# EAGLE design Xonik Waveshaper v2.1 (EAGLE 9.6.2)
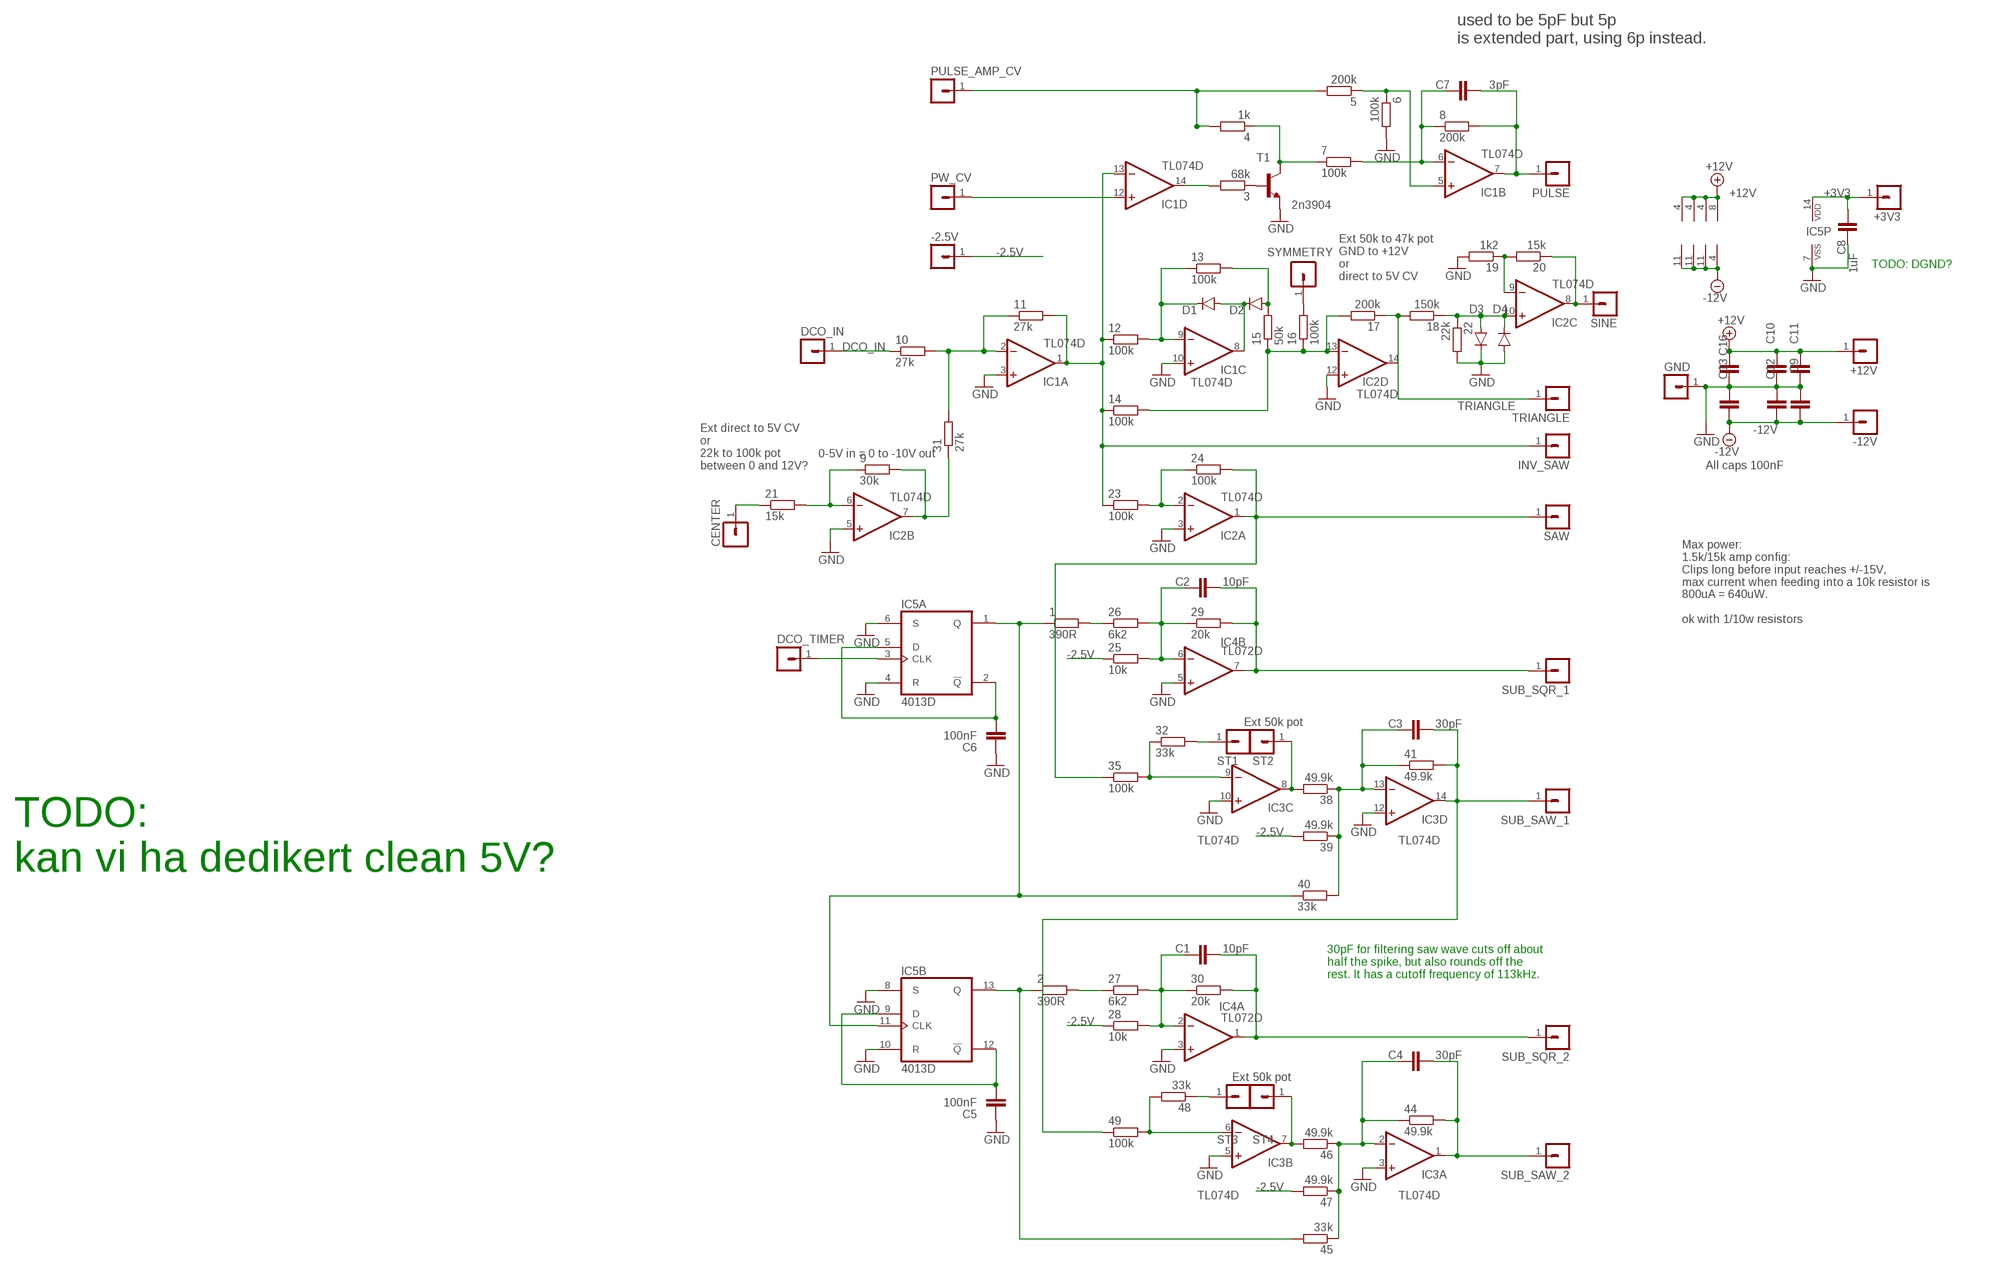
[diagram p0: schematic, sheet 1]

## Parts
1  390R  R-EU_R0603  [R0603]
2  390R  R-EU_R0603  [R0603]
3  68k  R-EU_R0603  [R0603]
4  1k  R-EU_R0603  [R0603]
5  200k  R-EU_R0603  [R0603]
6  100k  R-EU_R0603  [R0603]
7  100k  R-EU_R0603  [R0603]
8  200k  R-EU_R0603  [R0603]
9  30k  R-EU_R0603  [R0603]
10  27k  R-EU_R0603  [R0603]
11  27k  R-EU_R0603  [R0603]
12  100k  R-EU_R0603  [R0603]
13  100k  R-EU_R0603  [R0603]
14  100k  R-EU_R0603  [R0603]
15  50k  R-EU_R0603  [R0603]
16  100k  R-EU_R0603  [R0603]
17  200k  R-EU_R0603  [R0603]
18  150k  R-EU_R0603  [R0603]
19  1k2  R-EU_R0603  [R0603]
20  15k  R-EU_R0603  [R0603]
21  15k  R-EU_R0603  [R0603]
22  22k  R-EU_R0805  [R0805]
23  100k  R-EU_R0603  [R0603]
24  100k  R-EU_R0603  [R0603]
25  10k  R-EU_R0603  [R0603]
26  6k2  R-EU_R0603  [R0603]
27  6k2  R-EU_R0603  [R0603]
28  10k  R-EU_R0603  [R0603]
29  20k  R-EU_R0603  [R0603]
30  20k  R-EU_R0603  [R0603]
31  27k  R-EU_R0603  [R0603]
32  33k  R-EU_R0603  [R0603]
35  100k  R-EU_R0603  [R0603]
38  49.9k  R-EU_R0603  [R0603]
39  49.9k  R-EU_R0603  [R0603]
40  33k  R-EU_R0603  [R0603]
41  49.9k  R-EU_R0603  [R0603]
44  49.9k  R-EU_R0603  [R0603]
45  33k  R-EU_R0603  [R0603]
46  49.9k  R-EU_R0603  [R0603]
47  49.9k  R-EU_R0603  [R0603]
48  33k  R-EU_R0603  [R0603]
49  100k  R-EU_R0603  [R0603]
+3V3  MA01-1JP  [SIP-PIN01-1J]
+12V  MA01-1JP  [SIP-PIN01-1J]
-2.5V  MA01-1JP  [SIP-PIN01-1J]
-12V  MA01-1JP  [SIP-PIN01-1J]
C1  10pF  C-EUC0603  [C0603]
C2  10pF  C-EUC0603  [C0603]
C3  30pF  C-EUC0603  [C0603]
C4  30pF  C-EUC0603  [C0603]
C5  100nF  C-EUC0603  [C0603]
C6  100nF  C-EUC0603  [C0603]
C7  3pF  C-EUC0603  [C0603]
C8  1uF  C-EUC0402  [C0402]
C9  1uF  C-EUC0402  [C0402]
C10  1uF  C-EUC0402  [C0402]
C11  1uF  C-EUC0402  [C0402]
C12  1uF  C-EUC0402  [C0402]
C13  1uF  C-EUC0402  [C0402]
C16  1uF  C-EUC0402  [C0402]
CENTER  MA01-1JP  [SIP-PIN01-1J]
D1  1N41480805  [D0805-J]
D2  1N41480805  [D0805-J]
D3  1N41480805  [D0805-J]
D4  1N41480805  [D0805-J]
DCO_IN  MA01-1JP  [SIP-PIN01-1J]
DCO_TIMER  MA01-1JP  [SIP-PIN01-1J]
GND  MA01-1JP  [SIP-PIN01-1J]
IC1  TL074D  [SO14]
IC2  TL074D  [SO14]
IC3  TL074D  [SO14]
IC4  TL072D  [SO08J]
IC5  4013D  [SO14J]
INV_SAW  MA01-1JP  [SIP-PIN01-1J]
PULSE  MA01-1JP  [SIP-PIN01-1J]
PULSE_AMP_CV  MA01-1JP  [SIP-PIN01-1J]
PW_CV  MA01-1JP  [SIP-PIN01-1J]
SAW  MA01-1JP  [SIP-PIN01-1J]
SINE  MA01-1JP  [SIP-PIN01-1J]
ST1  MA01-1JP  [SIP-PIN01-1J]
ST2  MA01-1JP  [SIP-PIN01-1J]
ST3  MA01-1JP  [SIP-PIN01-1J]
ST4  MA01-1JP  [SIP-PIN01-1J]
SUB_SAW_1  MA01-1JP  [SIP-PIN01-1J]
SUB_SAW_2  MA01-1JP  [SIP-PIN01-1J]
SUB_SQR_1  MA01-1JP  [SIP-PIN01-1J]
SUB_SQR_2  MA01-1JP  [SIP-PIN01-1J]
SYMMETRY  MA01-1JP  [SIP-PIN01-1J]
T1  2n3904  MMBT3904LT1-NPN-SOT23-BEC  [SOT23-BEC]
TRIANGLE  MA01-1JP  [SIP-PIN01-1J]

## Nets
+3V3: +3V3.1 C8.2 IC5.14(P:VDD)
+12V: +12V.1 C10.2 C11.2 C16.2 IC1.4(P:V+) IC2.4(P:V+) IC3.4(P:V+) IC4.8(P:V+)
-2.5V: 25.1 28.1 39.2 47.2 -2.5V.1
-12V: -12V.1 C9.1 C12.1 C13.1 IC1.11(P:V-) IC2.11(P:V-) IC3.11(P:V-) IC4.4(P:V-)
AMP_CV: 4.2 5.2 PULSE_AMP_CV.1
DCO_IN: 10.1 DCO_IN.1
GND: 6.2 19.2 22.2 C5.1 C6.1 C8.1 C9.2 C10.1 C11.1 C12.2 C13.2 C16.1 D3.C D4.A GND.1 IC1.3(A:+IN) IC1.10(C:+IN) IC2.3(A:+IN) IC2.5(B:+IN) IC2.12(D:+IN) IC3.3(A:+IN) IC3.5(B:+IN) IC3.10(C:+IN) IC3.12(D:+IN) IC4.3(A:+IN) IC4.5(B:+IN) IC5.4(A:R) IC5.6(A:S) IC5.7(P:VSS) IC5.8(B:S) IC5.10(B:R) T1.E
N$1: 9.1 21.2 IC2.6(B:-IN)
N$2: 3.2 IC1.14(D:OUT)
N$3: 3.1 T1.B
N$4: 4.1 7.1 T1.C
N$5: 5.1 6.1 IC1.5(B:+IN)
N$6: 7.2 8.1 C7.1 IC1.6(B:-IN)
N$7: 8.2 C7.2 IC1.7(B:OUT) PULSE.1
N$8: 1.2 26.1
N$9: 11.2 12.1 14.1 23.1 IC1.1(A:OUT) IC1.13(D:-IN) INV_SAW.1
N$10: 10.2 11.1 31.2 IC1.2(A:-IN)
N$11: 12.2 13.1 D1.C IC1.9(C:-IN)
N$12: D1.A D2.C IC1.8(C:OUT)
N$13: 13.2 15.2 D2.A
N$14: 14.2 15.1 16.1 17.2 IC2.13(D:-IN)
N$15: 23.2 24.1 IC2.2(A:-IN)
N$16: 24.2 35.1 IC2.1(A:OUT) SAW.1
N$17: 29.2 C2.2 IC4.7(B:OUT) SUB_SQR_1.1
N$18: 30.2 C1.2 IC4.1(A:OUT) SUB_SQR_2.1
N$19: 25.2 26.2 29.1 C2.1 IC4.6(B:-IN)
N$20: 46.2 IC3.7(B:OUT) ST4.1
N$21: 48.2 49.2 IC3.6(B:-IN)
N$22: 27.2 28.2 30.1 C1.1 IC4.2(A:-IN)
N$23: 32.2 ST1.1
N$24: 32.1 35.2 IC3.9(C:-IN)
N$25: 2.2 27.1
N$26: 38.1 39.1 40.2 41.1 C3.1 IC3.13(D:-IN)
N$27: 41.2 49.1 C3.2 IC3.14(D:OUT) SUB_SAW_1.1
N$28: 48.1 ST3.1
N$29: 44.1 45.1 46.1 47.1 C4.1 IC3.2(A:-IN)
N$30: 44.2 C4.2 IC3.1(A:OUT) SUB_SAW_2.1
N$31: C6.2 IC5.2(A:!Q) IC5.5(A:D)
N$32: 1.1 40.1 IC5.1(A:Q) IC5.11(B:CLK)
N$33: IC1.12(D:+IN) PW_CV.1
N$34: C5.2 IC5.9(B:D) IC5.12(B:!Q)
N$35: 2.1 45.2 IC5.13(B:Q)
N$36: 19.1 20.2 IC2.9(C:-IN)
N$37: 16.2 SYMMETRY.1
N$38: 21.1 CENTER.1
N$39: 18.1 22.1 D3.A D4.C IC2.10(C:+IN)
N$40: 20.1 IC2.8(C:OUT) SINE.1
N$41: 38.2 IC3.8(C:OUT) ST2.1
N$42: 9.2 31.1 IC2.7(B:OUT)
SQR: DCO_TIMER.1 IC5.3(A:CLK)
TRIANGLE: 17.1 18.2 IC2.14(D:OUT) TRIANGLE.1

## Notes on the sheet
- used to be 5pF but 5p
  is extended part, using 6p instead.
- TODO: DGND?
- Ext 50k to 47k pot 
  GND to +12V
  or
  direct to 5V CV
- 0-5V in = 0 to -10V out
- Ext direct to 5V CV
  or 
  22k to 100k pot
  between 0 and 12V?
- All caps 100nF
- Max power:
  1.5k/15k amp config:
  Clips long before input reaches +/-15V,
  max current when feeding into a 10k resistor is
  800uA = 640uW. 
  
  ok with 1/10w resistors
- Ext 50k pot
- TODO: 
  kan vi ha dedikert clean 5V?
- 30pF for filtering saw wave cuts off about
  half the spike, but also rounds off the
  rest. It has a cutoff frequency of 113kHz.
- Ext 50k pot

## Library data of the parts
1-21 23-32 35 38-41 44-49 = rcl:R-EU_: RESISTOR, European symbol; SPICEPREFIX: R
22 = resistor:R-EU_: RESISTOR, European symbol
+3V3 +12V -2.5V -12V CENTER DCO_IN DCO_TIMER GND INV_SAW PULSE PULSE_AMP_CV PW_CV SAW SINE ST1-ST4 SUB_SAW_1 SUB_SAW_2 SUB_SQR_1 SUB_SQR_2 SYMMETRY TRIANGLE = joakim:MA01-1J: PIN HEADER
C1-C13 C16 = rcl:C-EU: CAPACITOR, European symbol; SPICEPREFIX: C
D1-D4 = joakim:1N4148: DIODE high speed (Philips)
IC1-IC3 = linear:TL074: OP AMP
IC4 = joakim:TL072: OP AMP
IC5 = joakim:4013: Dual D FLIP FLOP, set/reset
T1 = transistor-neu-to92:*-NPN-: NPN Transistror

## Board
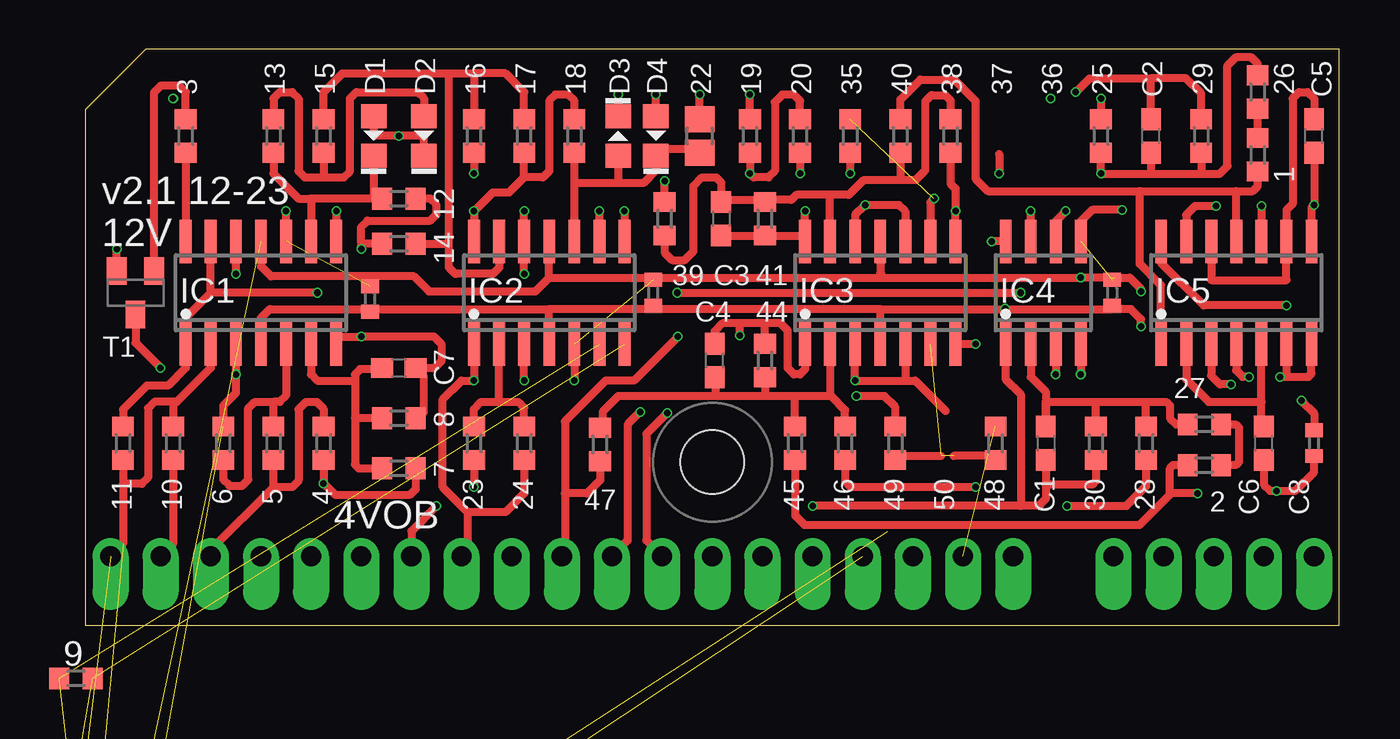
[diagram p1: board, top side]
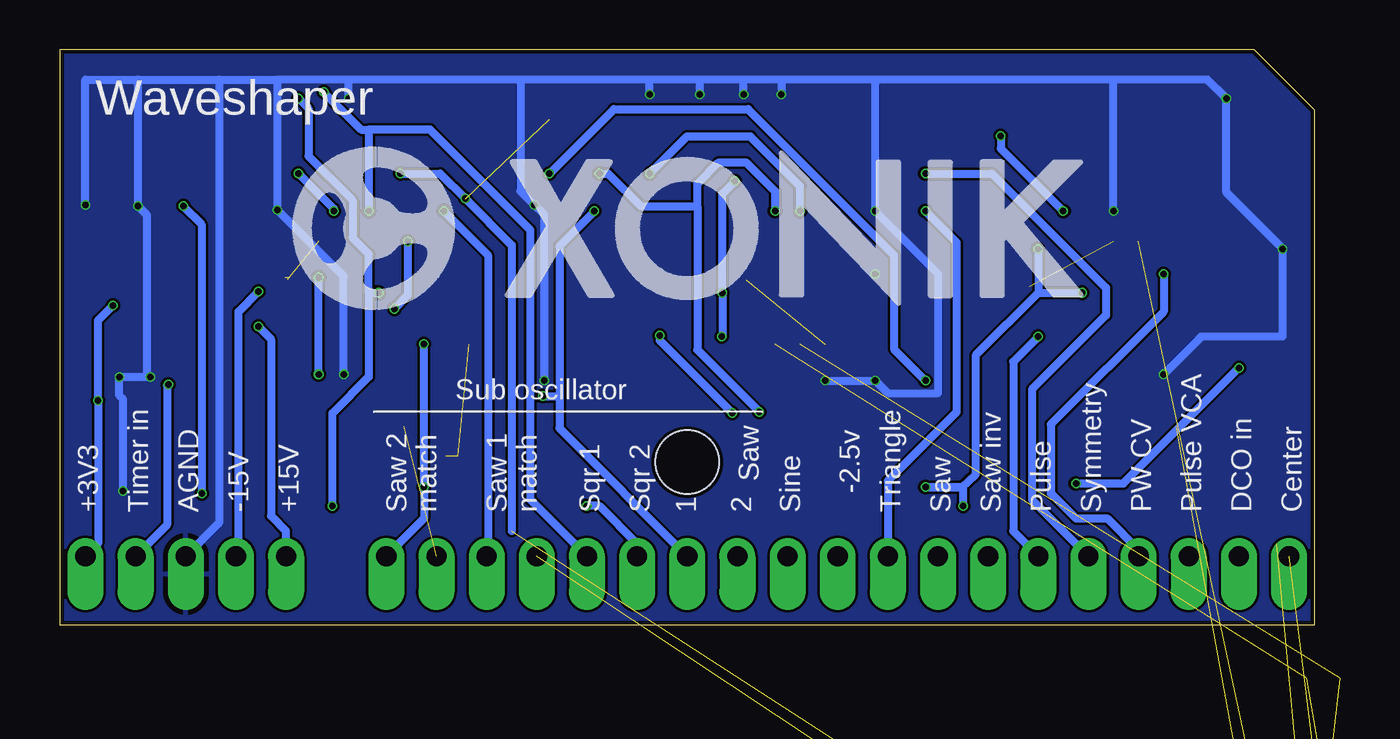
[diagram p2: board, bottom side, seen from below]

Size 63.5 x 29.15 mm. Coordinates in mm from the lower left corner, seen from the top.
Outline: 0,0 63.5,0 63.5,29.15 3.05,29.15 0,26.1 0,0
Copper layers (1*16): Top 0.035mm / dielectric 1.6mm / Bottom 0.035mm
Design rules "jlcpcb-2layers": minimum track width 5mil, minimum drill 0.3mm, track to track 5mil, track to pad 5mil, pad to pad 5mil, via to via 5mil, smd to smd 5mil, copper to edge 0.2mm, drill to drill 6mil, minimum pad ring 10mil, minimum via ring 3mil, stop-mask expansion 4mil, vias tented up to drill 0mil, thermal gap 10mil
Holes 3.2 mm at 31.75,8.26

### Footprints (pad centres in the part's own frame; a part is rotated, then mirrored left to right if it is on the bottom)
R0603 = smd 1 x 1.1: 1 -0.85,0; 2 0.85,0
R0805 = smd 1.3 x 1.5: 1 -0.85,0; 2 0.85,0
SIP-PIN01-1J = drill 1.016 offset: 1 0,0
C0603 = smd 1.1 x 1: 1 -0.85,0; 2 0.85,0
C0402 = smd 0.7 x 0.9: 1 -0.65,0; 2 0.65,0
D0805-J = smd 1.2 x 1.3: A -1,0; C 1,0
SO14 = smd 0.6 x 2.2: 1 -3.81,-2.6; 2 -2.54,-2.6; 3 -1.27,-2.6; 4 0,-2.6; 5 1.27,-2.6; 6 2.54,-2.6; 7 3.81,-2.6; 8 3.81,2.6; 9 2.54,2.6; 10 1.27,2.6; 11 0,2.6; 12 -1.27,2.6; 13 -2.54,2.6; 14 -3.81,2.6
SO08J = smd 0.6 x 2.2: 1 -1.905,-2.6; 2 -0.635,-2.6; 3 0.635,-2.6; 4 1.905,-2.6; 5 1.905,2.6; 6 0.635,2.6; 7 -0.635,2.6; 8 -1.905,2.6
SO14J = smd 0.6 x 2.2: 1 -3.81,-2.6; 2 -2.54,-2.6; 3 -1.27,-2.6; 4 0,-2.6; 5 1.27,-2.6; 6 2.54,-2.6; 7 3.81,-2.6; 8 3.81,2.6; 9 2.54,2.6; 10 1.27,2.6; 11 0,2.6; 12 -1.27,2.6; 13 -2.54,2.6; 14 -3.81,2.6
SOT23-BEC = smd 1 x 1.4: B -0.95,-1.1; C 0,1.1; E 0.95,-1.1

### Placement (x,y rotation side)
1  59.37,23.81 90 top
2  56.67,8.1 0 top
3  5.08,24.77 270 top
4  12.06,9.21 90 top
5  9.53,9.21 270 top
6  6.99,9.21 90 top
7  15.88,7.94 180 top
8  15.88,10.48 0 top
9  -0.48,-2.7 0 top
10  4.45,9.21 90 top
11  1.91,9.21 90 top
12  15.88,21.59 180 top
13  9.53,24.77 90 top
14  15.88,19.3 0 top
15  12.06,24.77 270 top
16  19.68,24.77 270 top
17  22.23,24.77 90 top
18  24.77,24.77 90 top
19  33.66,24.77 90 top
20  36.2,24.77 90 top
21  -0.48,-17.46 0 top  (outside the outline)
22  31.11,24.77 90 top
23  19.68,9.21 90 top
24  22.23,9.21 270 top
25  51.44,24.77 270 top
26  59.37,26.99 90 top
27  56.67,10.16 180 top
28  53.72,9.21 90 top
29  56.52,24.77 90 top
30  51.18,9.21 270 top
31  -0.48,-12.54 0 top  (outside the outline)
32  -0.48,-22.38 0 top  (outside the outline)
35  38.73,24.77 90 top
38  43.81,24.77 270 top
39  29.34,20.57 90 top
40  41.27,24.77 270 top
41  34.42,20.57 270 top
44  34.42,13.4 90 top
45  35.94,9.21 270 top
46  38.48,9.21 270 top
47  26.07,9.14 270 top
48  46.1,9.21 270 top
49  41.02,9.21 270 top
+3V3  62.23,3.49 0 top
+12V  52.07,3.49 0 top
-2.5V  24.13,3.49 0 top
-12V  54.61,3.49 0 top
C1  48.64,9.21 270 top
C2  53.98,24.77 90 top
C3  32.19,20.57 270 top
C4  31.88,13.4 90 top
C5  62.23,24.77 90 top
C6  59.69,9.21 90 top
C7  15.88,13.02 0 top
C8  62.23,9.21 90 top
C9  -0.48,-27.3 0 top  (outside the outline)
C10  28.77,16.83 270 top
C11  14.41,16.51 270 top
C12  -0.48,-32.23 0 top  (outside the outline)
C13  -0.48,-37.15 0 top  (outside the outline)
C16  52.01,16.83 270 top
CENTER  1.27,3.49 0 top
D1  14.61,24.77 270 top
D2  17.14,24.77 270 top
D3  26.99,24.77 90 top
D4  28.89,24.77 270 top
DCO_IN  3.81,3.49 0 top
DCO_TIMER  59.69,3.49 0 top
GND  57.15,3.49 0 top
IC1  8.89,16.83 0 top
IC2  23.5,16.83 0 top
IC3  40.26,16.83 0 top
IC4  48.51,16.83 0 top
IC5  58.29,16.83 0 top
INV_SAW  16.51,3.49 0 top
PULSE  13.97,3.49 0 top
PULSE_AMP_CV  6.35,3.49 0 top
PW_CV  8.89,3.49 0 top
SAW  19.05,3.49 0 top
SINE  26.67,3.49 0 top
ST1  39.37,3.49 0 top
ST2  41.91,3.49 0 top
ST3  44.45,3.49 0 top
ST4  46.99,3.49 0 top
SUB_SAW_1  31.75,3.49 0 top
SUB_SAW_2  29.21,3.49 0 top
SUB_SQR_1  36.83,3.49 0 top
SUB_SQR_2  34.29,3.49 0 top
SYMMETRY  11.43,3.49 0 top
T1  2.54,16.83 180 top
TRIANGLE  21.59,3.49 0 top
U$1  [XONIK_LOGO_40]  51.72,16.02 0 bottom

### Tracks (layer width: path | path; a pad name or v marks a point on that pad's centre or on a via)
+3V3  (via drill 0.33)
  Top 0.406: v60.83,16.19 56.64,16.19 54.48,18.35 IC5.14 | v61.59,11.37 62.23,10.73 C8.2
  Bottom 0.406: +3V3.1 61.59,4.13 v61.59,11.37 61.59,15.43 v60.83,16.19
+12V  (via drill 0.33, 0.35)
  Top 0.152: IC1.4 8.89,14.35
  Top 0.406: 8.89,14.35 8.89,15.56 9.34,16 14.29,16 | 14.29,16 23.5,16 | 23.5,16 28.72,16 C10.2 28.82,16 40.26,16 | IC2.4 23.5,16 | IC3.4 40.26,16 | IC4.8 v45.91,19.43 | C11.2 14.41,15.88 14.29,16 | 51.96,16 C16.2 | 40.26,16 46.57,16 | 46.57,16 51.96,16 | v46.58,16.02 46.57,16 | v53.47,15.11 53.47,15.49 52.96,16 51.96,16
  Bottom 0.406: +12V.1 52.07,4.76 52.83,5.52 52.83,14.48 v53.47,15.11 | v46.58,16.02 45.91,16.69 v45.91,19.43
-2.5V  (via drill 0.33)
  Top 0.406: v29.97,16.83 v47.37,16.83 | 28.1 53.72,7.02 52.73,6.03 v49.72,6.03 | v51.44,26.67 25.1 | 39.2 v29.34,22.48 | v30,14.61 27.78,12.38 26.35,12.38 24.29,10.32 24.29,6.67 | 47.2 26.07,7.33 25.4,6.67 24.29,6.67 | 24.29,6.67 24.29,3.65 -2.5V.1
  Bottom 0.406: v29.34,22.48 29.97,21.84 v29.97,16.83 29.97,14.64 v30,14.61 | v49.72,6.03 49.72,10.73 47.88,12.57 47.88,16.83 | v51.44,26.67 50.93,26.16 50.93,23.75 48.7,21.53 48.7,19.62 47.88,18.8 47.88,16.83 | 47.88,16.83 v47.37,16.83
-12V  (via drill 0.33)  (4 unrouted)
  Top 0.406: IC1.11 8.89,18.16 9.4,17.65 14.41,17.65 16.64,17.65 17.4,16.89 22.73,16.89 22.8,16.89 23.5,17.59 | 23.5,17.59 28.65,17.59 40.45,17.59 | 40.45,17.59 40.26,17.78 IC3.11 | 40.45,17.59 v50.42,17.59 51.89,17.59 | IC4.4 v50.42,12.7 | 23.5,17.59 IC2.11 | 52.12,17.59 52.9,17.59 53.47,17.02 v53.47,16.89
  Bottom 0.406: -12V.1 54.48,3.62 54.48,15.88 v53.47,16.89 | v50.42,12.7 v50.42,17.59
AMP_CV
  Top 0.406: 4.2 12.06,10.95 11.72,11.3 11.18,11.3 10.79,10.92 10.79,7.3 10.48,6.99 9.53,6.99 | PULSE_AMP_CV.1 6.35,3.81 9.53,6.99 | 9.53,6.99 5.2
DCO_IN
  Top 0.406: 10.1 4.45,4.13 DCO_IN.1
GND  (via drill 0.33)  (6 unrouted)
  Top 0.406: IC3.12 38.99,20.77 v39.5,21.27 41.21,21.27 41.53,20.95 IC3.10 | IC3.5 41.53,12.38 | IC3.3 v38.99,12.38 41.53,12.38 | C5.1 v62.23,21.27 62.1,21.14 IC5.8 | v52.51,21.02 50.99,21.02 50.42,20.45 IC4.5 | 43.56,10.85 42.03,12.38 41.53,12.38 | v22.23,20.95 IC2.12 v22.23,17.78 | v22.23,12.38 IC2.3 | v59.56,21.21 IC5.10 | IC4.3 v49.15,12.7 | IC5.4 58.29,12.89 58.61,12.57 v58.93,12.57 | 6.2 6.99,11.11 7.62,11.75 IC1.3 v7.62,12.7 | IC1.10 v10.16,20.95 | v26.99,26.86 D3.C | T1.E v1.59,19.05 | C6.1 59.69,7.11 60.01,6.79 v60.33,6.79 61.28,6.79 62.23,7.75 C8.1 | D4.A v28.89,26.86 | 22.2 v31.11,26.86 | 19.2 v33.66,26.86 | IC2.5 v24.77,12.38 | v60.52,12.57 60.8,12.57 | 60.8,12.57 61.94,12.57 62.1,12.73 IC5.7 | IC5.6 60.83,12.61 60.8,12.57
  Bottom 0.406: v62.23,21.27 62.23,27.62 59.56,27.62 | 59.56,27.62 55.47,27.62 | 55.47,27.62 52.51,27.62 | 52.51,27.62 v52.51,21.02 49.15,17.65 v49.15,12.7 | 40.2,27.62 40.2,21.97 v39.5,21.27 38.99,20.77 v38.99,12.38 | 40.2,27.62 48.9,27.62 | 48.9,27.62 52.51,27.62 | 26.99,27.62 28.89,27.62 | 28.89,27.62 31.11,27.62 | 31.11,27.62 33.66,27.62 | 33.66,27.62 40.2,27.62 | 59.56,27.62 v59.56,21.21 59.12,20.77 59.12,12.76 v58.93,12.57 v60.52,12.57 60.52,11.62 60.33,11.43 v60.33,6.79 | GND.1 55.47,5.17 55.47,27.62 | v10.16,20.95 10.16,27.62 | 10.16,27.62 22.23,27.62 | 22.23,27.62 26.99,27.62 | 26.99,27.62 v26.99,26.86 | 10.16,27.62 5.4,27.62 v4.45,26.67 4.45,21.91 v1.59,19.05 1.59,14.61 5.71,14.61 v7.62,12.7 | 22.23,27.62 v22.23,20.95 19.05,17.78 19.05,11.75 21.59,11.75 v22.23,12.38 v24.77,12.38 | v48.9,26.67 48.9,27.62 | v31.11,26.86 31.11,27.62 | v28.89,26.86 28.89,27.62 | v33.66,26.86 33.66,27.62
  pour Bottom: -0.51,29.34 64.2,29.34 64.52,29.02 64.52,0.32 64.07,-0.13 -0.51,-0.13 -0.83,0.19 -0.83,29.02
N$1  (2 unrouted)
N$2
  Top 0.406: 3.2 IC1.14
N$3
  Top 0.406: T1.B 3.49,17.61 3.49,26.99 3.81,27.3 4.76,27.3 5.08,26.99 3.1
N$4  (via drill 0.33)
  Top 0.406: T1.C 2.54,14.29 v3.81,13.02 | 7.1 16.73,6.88 16.45,6.6 12.64,6.6 v12.06,7.18 4.1
  Bottom 0.406: v12.06,7.18 9.65,7.18 v3.81,13.02
N$5
  Top 0.406: IC1.5 10.16,11.62 9.84,11.3 9.53,11.3 | 6.1 6.99,7.37 7.3,7.05 7.94,7.05 8.26,7.37 8.26,10.99 8.57,11.3 9.53,11.3 | 5.1 9.53,11.3
N$6
  Top 0.406: IC1.6 11.43,12.7 11.75,12.38 13.65,12.38 | C7.1 14.96,12.95 13.91,12.95 13.65,12.7 13.65,12.38 | 13.65,12.38 13.65,10.48 | 13.65,10.48 13.65,8.13 13.84,7.94 7.2 | 8.1 13.65,10.48
N$7  (via drill 0.33)
  Top 0.406: IC1.7 12.7,14.61 v13.97,14.61 17.65,14.61 18.03,14.22 18.03,13.37 17.68,13.02 C7.2 17.14,12.6 17.14,10.79 16.83,10.48 8.2
  Bottom 0.406: PULSE.1 15.24,4.76 15.24,13.34 v13.97,14.61
N$8
  Top 0.406: 1.2 26.1
N$9  (via drill 0.33)
  Top 0.406: 11.2 1.91,10.92 3.11,12.13 4.19,12.13 5.08,13.02 IC1.1 5.08,15.56 6.35,16.83 | 6.35,16.83 IC1.13 | v11.75,16.83 6.35,16.83 | 23.1 v19.68,6.99 | v17.78,6.03 16.51,4.76 INV_SAW.1 | 12.1 17.46,21.59 17.78,21.27 17.78,20.8 17.46,20.48 14.29,20.48 13.97,20.16 13.97,19.37 14.03,19.3 | 14.1 14.03,19.3 | v13.97,19.05 13.97,19.24 14.03,19.3
  Bottom 0.406: v17.78,6.03 17.78,6.99 v19.68,6.99 17.85,6.99 17.14,7.62 17.14,13.65 13.97,16.83 | v13.97,19.05 13.97,16.83 | 13.97,16.83 v11.75,16.83
N$10  (1 unrouted)
  Top 0.406: IC1.2 6.35,13.02 4.64,11.3 4.51,11.3 | 4.51,11.3 4.45,11.24 10.2 | 4.51,11.3 3.49,11.3 3.17,10.99 3.17,7.46 2.86,7.14 1.91,7.14 | 11.1 1.91,7.14 | 1.91,7.14 1.91,4.13
N$11
  Top 0.406: 13.1 9.53,22.86 10.79,21.59 11.43,21.59 | 11.43,21.59 IC1.9 | 14.61,21.91 15.24,21.91 15.03,21.69 12.2 | 11.43,21.59 14.61,21.59 14.61,21.91 | D1.C 14.61,21.91
N$12  (via drill 0.33)
  Top 0.406: v12.7,20.95 IC1.8 | D1.A 14.61,24.77 v15.88,24.77 17.14,24.77 D2.C
  Bottom 0.406: v15.88,24.77 15.88,24.13 v12.7,20.95
N$13
  Top 0.406: D2.A 17.14,26.67 16.83,26.99 13.72,26.99 13.4,26.67 13.4,22.99 13.08,22.67 12.06,22.67 | 13.2 9.53,26.67 9.84,26.99 10.48,26.99 10.79,26.67 10.79,22.99 11.11,22.67 12.06,22.67 | 15.2 12.06,22.67
N$14
  Top 0.406: 15.1 12.06,26.99 13.02,27.94 18.41,27.94 | 18.41,27.94 19.68,27.94 | 19.68,27.94 16.1 | 17.2 22.23,26.99 21.27,27.94 19.68,27.94 | 14.2 18.41,19.3 | 18.41,19.3 18.41,27.94 | IC2.13 20.95,18.1 20.64,17.78 18.73,17.78 18.41,18.1 18.41,19.3
N$15
  Top 0.406: 23.2 19.68,10.95 20,11.27 20.95,11.27 | 24.1 22.23,11.01 21.96,11.27 20.95,11.27 | 20.95,11.27 IC2.2
N$16  (via drill 0.33)
  Top 0.406: IC2.1 v19.68,12.38 19.05,12.38 18.1,11.43 18.1,6.99 19.37,5.71 | 35.1 v38.73,22.86 | 19.37,5.71 21.27,5.71 22.23,6.67 24.2 | SAW.1 19.37,3.81 19.37,5.71
  Bottom 0.406: v38.73,22.86 35.47,26.13 28.67,26.13 21.27,18.73 21.27,13.97 v19.68,12.38
N$17  (via drill 0.33)
  Top 0.406: IC4.7 v47.88,20.95 | 53.98,27.69 50.86,27.69 v50.16,26.99 | 29.2 56.52,26.92 55.75,27.69 53.98,27.69 | C2.2 53.98,27.69
  Bottom 0.406: 47.88,25.08 48.26,25.08 v50.16,26.99 | SUB_SQR_1.1 39.69,6.35 39.69,20 44.77,25.08 47.88,25.08 | 47.88,25.08 v47.88,20.95
N$18  (via drill 0.33)
  Top 0.406: IC4.1 46.61,12.45 47.37,11.69 47.37,6.03 | C1.2 48.64,7.11 | 48.64,7.11 48.64,6.39 48.32,6.07 48.32,6.03 47.37,6.03 | 47.37,6.03 v36.83,6.03 | 30.2 51.18,7.3 50.99,7.11 48.64,7.11
  Bottom 0.406: SUB_SQR_2.1 34.29,4.13 36.2,6.03 v36.83,6.03
N$19  (via drill 0.33)
  Top 0.406: v49.66,20.95 49.15,20.44 IC4.6 | 26.2 59.37,28.43 59.05,28.74 58.26,28.74 57.85,28.33 57.85,23.24 57.47,22.86 56.52,22.86 | 53.98,22.86 v51.44,22.86 25.2 | 53.98,22.86 56.52,22.86 | 29.1 56.52,22.86 | C2.1 53.98,22.86
  Bottom 0.406: v51.44,22.86 49.66,21.08 v49.66,20.95
N$20  (via drill 0.33)
  Top 0.406: v45.09,6.99 38.77,6.99 38.48,7.28 46.2 | v45.09,14.22 IC3.7
  Bottom 0.406: v45.09,14.22 v45.09,6.99 45.09,5.4 ST4.1
N$21  (2 unrouted)
  Top 0.406: 48.2 46.1,8.57 43.98,8.57 | 49.2 41.02,8.57 43.35,8.57
N$22
  Top 0.406: 51.18,11.3 48.64,11.3 C1.1 48.64,11.81 47.88,12.57 IC4.2 | 30.1 51.18,11.3 | 51.18,11.3 53.72,11.3 | 28.2 53.72,11.3 | 53.72,11.3 54.74,11.3 54.93,11.11 54.93,10.48 55.24,10.16 27.2
N$23  (1 unrouted)
N$24  (via drill 0.33)  (2 unrouted)
  Top 0.406: v42.99,21.59 42.8,21.4 IC3.9 | 46.29,23.85 v46.29,22.86
  Bottom 0.406: 40.64,4.76 40.64,19.24 v42.99,21.59 44.26,22.86 v46.29,22.86
N$25
  Top 0.406: 27.1 58.26,10.16 58.42,10 58.42,8.26 58.26,8.1 2.2
N$26
  Top 0.406: IC3.13 37.72,21.78 | 37.72,21.78 38.67,21.78 39.43,22.54 41.27,22.54 | 37.72,21.78 36.01,21.78 35.75,21.53 34.42,21.53 | 34.42,21.53 32.3,21.53 C3.1 32.19,22.42 31.94,22.67 31.24,22.67 30.8,22.23 30.8,18.92 30.35,18.48 29.72,18.48 29.34,18.86 39.1 | 41.1 34.42,21.53 | 38.1 43.81,26.57 43.55,26.83 42.86,26.83 42.55,26.51 42.55,23.02 42.07,22.54 41.27,22.54 | 40.2 41.27,22.54
N$27  (via drill 0.33)
  Top 0.406: v36.45,20.95 IC3.14 36.42,19.45 36.42,19.62 36.32,19.72 41.2 C3.2 | 49.1 41.02,11.05 40.48,11.59 v39.05,11.59
  Bottom 0.406: v36.45,20.95 38.23,19.18 38.23,11.59 | 38.23,11.59 38.23,9.97 SUB_SAW_1.1 | v39.05,11.59 38.23,11.59
N$28  (1 unrouted)
N$29
  Top 0.406: 47.1 26.19,10.12 26.19,10.79 26.99,11.59 31.91,11.59 | 46.1 38.48,10.89 37.78,11.59 | 37.78,11.59 36.04,11.59 | 36.04,11.59 34.45,11.59 | 34.45,11.59 31.91,11.59 | C4.1 31.91,12.52 31.91,11.59 | 44.1 34.42,11.62 34.45,11.59 | IC3.2 37.72,11.65 37.78,11.59 | 45.1 35.94,11.49 36.04,11.59
N$30  (via drill 0.33)
  Top 0.406: C4.2 31.88,14.88 32.3,15.3 33.18,15.3 | 33.18,15.3 34.45,15.3 | 34.45,15.3 35.18,15.3 35.56,14.92 35.56,13.02 35.88,12.7 36.2,12.7 36.45,12.95 IC3.1 | v29.46,10.73 28.42,9.68 28.42,4.29 SUB_SAW_2.1 | v33.15,14.67 33.15,15.27 33.18,15.3 | 44.2 34.42,15.27 34.45,15.3
  Bottom 0.406: v33.15,14.67 33.15,14.41 v29.46,10.73
N$31
  Top 0.406: 59.56,11.3 56.9,11.3 55.75,12.45 IC5.2 | 59.56,11.3 59.56,10.03 59.69,10.03 C6.2 | 59.56,11.3 IC5.5
N$32
  Top 0.406: IC5.11 58.29,21.97 | 40.1 41.27,26.61 42.29,27.62 44.01,27.62 45.09,26.54 45.09,22.61 45.72,21.97 53.4,21.97 | IC5.1 54.48,17.21 53.4,18.29 53.4,21.97 | 53.4,21.97 58.29,21.97 | 58.29,21.97 59.12,21.97 59.37,22.23 1.1
N$33  (via drill 0.33)
  Top 0.406: IC1.12 v7.62,17.78
  Bottom 0.406: PW_CV.1 8.89,3.81 10.48,5.4 12.06,5.4 13.34,6.67 13.34,10.16 7.62,15.88 v7.62,17.78
N$34
  Top 0.406: C5.2 62.23,26.67 61.91,26.99 61.47,26.99 61.15,26.67 61.15,21.33 60.83,21.02 IC5.9 60.83,17.46 57.02,17.46 IC5.12
N$35  (via drill 0.33)
  Top 0.406: v57.28,21.21 56.2,21.21 55.75,20.77 IC5.13 | 45.2 35.94,5.56 36.42,5.08 53.4,5.08 54.93,6.6 | 2.1 55.09,8.1 54.93,7.94 54.93,6.6 | 54.93,6.6 54.99,6.67 v56.33,6.67
  Bottom 0.406: v56.33,6.67 56.36,6.67 56.36,20.29 v57.28,21.21
N$36  (via drill 0.33)
  Top 0.406: IC2.9 v26.04,20.95 | 19.1 v33.66,22.86 33.85,22.67 34.61,22.67 34.92,22.99 34.92,26.48 35.31,26.86 35.88,26.86 36.2,26.54 20.2
  Bottom 0.406: v26.04,20.95 26.04,22.23 28.54,24.73 31.78,24.73 v33.66,22.86
N$37  (via drill 0.33)
  Top 0.406: 16.2 v19.68,22.86
  Bottom 0.406: v19.68,22.86 16.32,22.86 10.54,17.08 10.54,15.68 14.29,11.94 14.29,6.35 SYMMETRY.1
N$38  (1 unrouted)
N$39
  Top 0.406: 29.26,24.13 D4.C | D4.C 28.57,24.13 29.26,24.13 | 29.26,24.13 31.01,24.13 22.1 | IC2.10 24.77,22.38 | 24.77,22.38 18.1 | D4.C 28.89,23.02 28.26,22.38 26.99,22.38 | 26.99,22.38 24.77,22.38 | D3.A 26.99,22.38
N$40  (via drill 0.33)
  Top 0.406: v27.3,20.95 IC2.8 | 20.1 v36.2,22.86 | v28.1,10.79 27.46,10.16 27.46,4.29 SINE.1
  Bottom 0.406: 31.24,21.21 31.24,22.35 30.16,23.43 28.77,23.43 27.3,21.97 v27.3,20.95 | v36.2,22.86 35.75,22.86 34.1,21.21 31.24,21.21 | v28.1,10.79 31.24,13.94 31.24,21.21
N$41  (via drill 0.33)
  Top 0.406: IC3.8 v44.07,20.95 44.07,22.1 43.81,22.35 38.2
  Bottom 0.406: v44.07,20.95 41.85,18.73 41.85,3.56 ST2.1
N$42  (2 unrouted)
SQR  (via drill 0.33)
  Top 0.406: IC5.3 57.02,12.64 57.47,12.19 v58.04,12.19
  Bottom 0.406: v58.04,12.19 58.1,12.13 58.1,5.08 DCO_TIMER.1
TRIANGLE  (via drill 0.33)
  Top 0.406: IC2.14 v19.68,20.95 20.64,21.91 21.46,21.91 22.23,22.67 | 18.2 24.77,26.54 24.45,26.86 23.81,26.86 23.5,26.54 23.5,22.99 23.18,22.67 22.23,22.67 | 22.23,22.67 17.1
  Bottom 0.406: TRIANGLE.1 21.59,7.3 18.1,10.79 18.1,19.37 v19.68,20.95

### Text on the board
tNames: 3 | 13 | 15 | D1 | D2 | 16 | 17 | 18 | D3 | D4 | 22 | 19 | 20 | 35 | 40 | 38 | 37 | 36 | 25 | C2 | 29 | 26 | C5 | 12 | v2.1 12-23 / 12V | 14 | 39 | C3 | 41 | IC1 | IC2 | IC3 | IC4 | IC5 | T1 | C4 | 44 | C7 | 27 | 8 | C1 | 11 | 10 | 6 | 5 | 4 | 7 | 23 | 24 | 45 | 46 | 49 | 50 | 48 | 30 | 28 | C6 | C8 | 47 | 4VOB
bNames: Waveshaper | Sub oscillator | -2.5v | Saw | Center | DCO in | Pulse VCA | PW CV | Symmetry | Pulse | Saw inv | Saw | Triangle | Sine | 2 | 1 | Sqr 2 | Sqr 1 | Saw 1 / match | Saw 2 / match | +15V | -15V | AGND | Timer in | +3V3